# EAGLE design Exp_Board_Melzi (EAGLE 6.4)
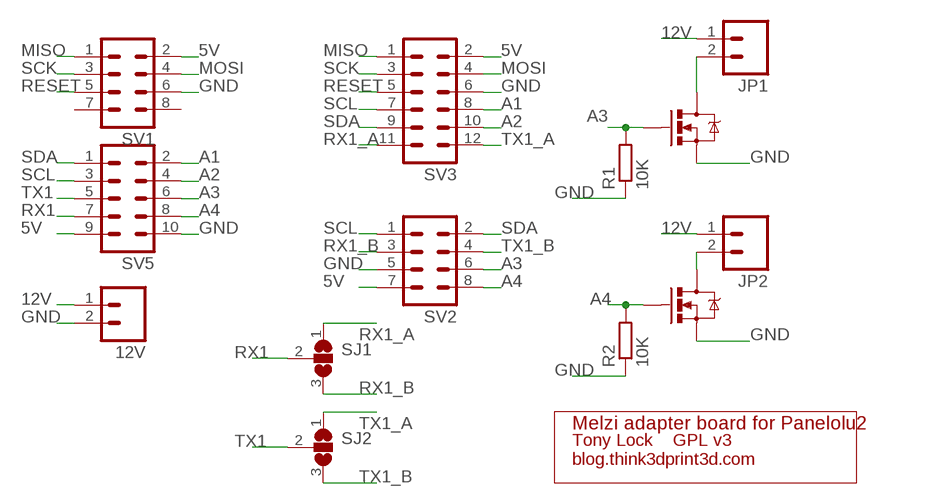
[diagram p0: schematic, sheet 1]

## Parts
12V  M02PTH  [1X02]
JP1  M02PTH  [1X02]
JP2  M02PTH  [1X02]
Q1  Transistor1  MOSFET-NCHANNELPTH2  [TO220V]
Q2  Transistor2  MOSFET-NCHANNELPTH2  [TO220V]
R1  10K  R-EU_0204/7  [0204/7]
R2  10K  R-EU_0204/7  [0204/7]
SJ1  SJ2W  [SJ_2]
SJ2  SJ2W  [SJ_2]
SV1  MA04-2  [MA04-2]
SV2  MA04-2  [MA04-2]
SV3  MA06-2  [MA06-2]
SV5  MA05-2  [MA05-2]

## Nets
5V: SV1.2 SV2.7 SV3.2 SV5.9
12V: JP1.1 JP2.1
A1: SV3.8 SV5.2
A2: SV3.10 SV5.4
A3: Q1.1(G) R1.2 SV2.6 SV5.6
A4: Q2.1(G) R2.2 SV2.8 SV5.8
GND: Q1.3(S) Q2.3(S) R1.1 R2.1 SV1.6 SV2.5 SV3.6 SV5.10
MISO: SV1.1 SV3.1
MOSI: SV1.4 SV3.4
N$1: JP1.2 Q1.2(D)
N$2: JP2.2 Q2.2(D)
RESET: SV1.5 SV3.5
RX1: SJ1.2 SV5.7
RX1_A: SJ1.1 SV3.11
RX1_B: SJ1.3 SV2.3
SCK: SV1.3 SV3.3
SCL: SV2.1 SV3.7 SV5.3
SDA: SV2.2 SV3.9 SV5.1
TX1: SJ2.2 SV5.5
TX1_A: SJ2.1 SV3.12
TX1_B: SJ2.3 SV2.4
Unconnected: 12V.1 12V.2 SV1.7 SV1.8

## Notes on the sheet
- Melzi adapter board for Panelolu2
- Tony Lock    GPL v3
  blog.think3dprint3d.com

## Library data of the parts
12V JP1 JP2 = SparkFun-Connectors:M02: Header 2 Standard 2-pin 0.1" header. Use with straight break away headers (SKU : PRT-00116), right angle break away headers (PRT-00553), swiss pins (PRT-00743), machine pins (PRT-00117), and female headers (PRT-00115). Molex polarized connector foot print use with SKU : PRT-08233 with associated crimp pins and housings.
Q1 Q2 = SparkFun-DiscreteSemi:MOSFET-NCHANNEL: Generic NMOS footprint
R1 R2 = resistor:R-EU_: RESISTOR, European symbol
SJ1 SJ2 = jumper:SJ2W: SMD solder JUMPER
SV1 SV2 = con-lstb_2:MA04-2: PIN HEADER; OC_FARNELL: unknown; OC_NEWARK: unknown
SV3 = con-lstb_2:MA06-2: PIN HEADER; OC_FARNELL: unknown; OC_NEWARK: unknown
SV5 = con-lstb_2:MA05-2: PIN HEADER; OC_FARNELL: unknown; OC_NEWARK: unknown

## Board
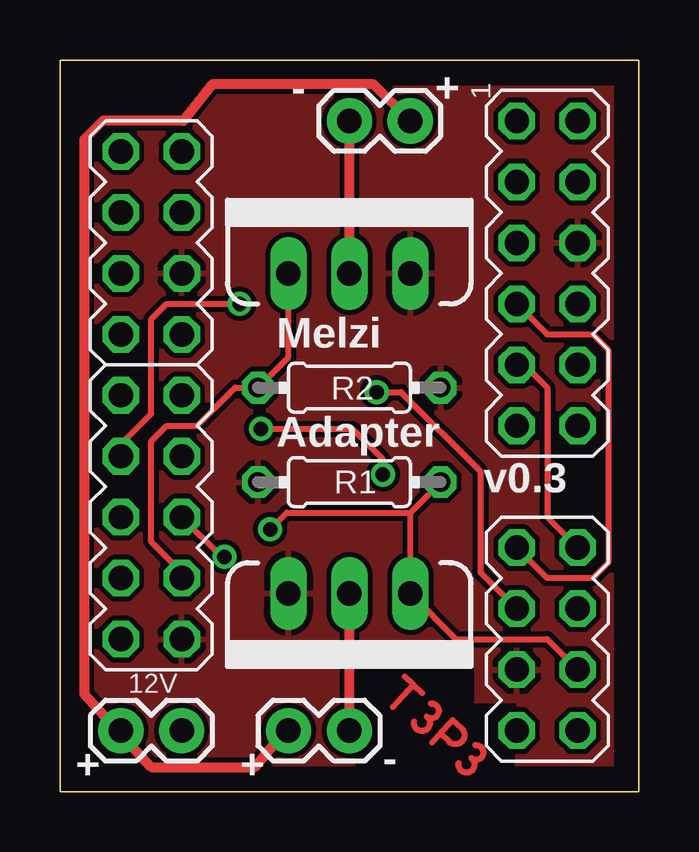
[diagram p1: board, top side]
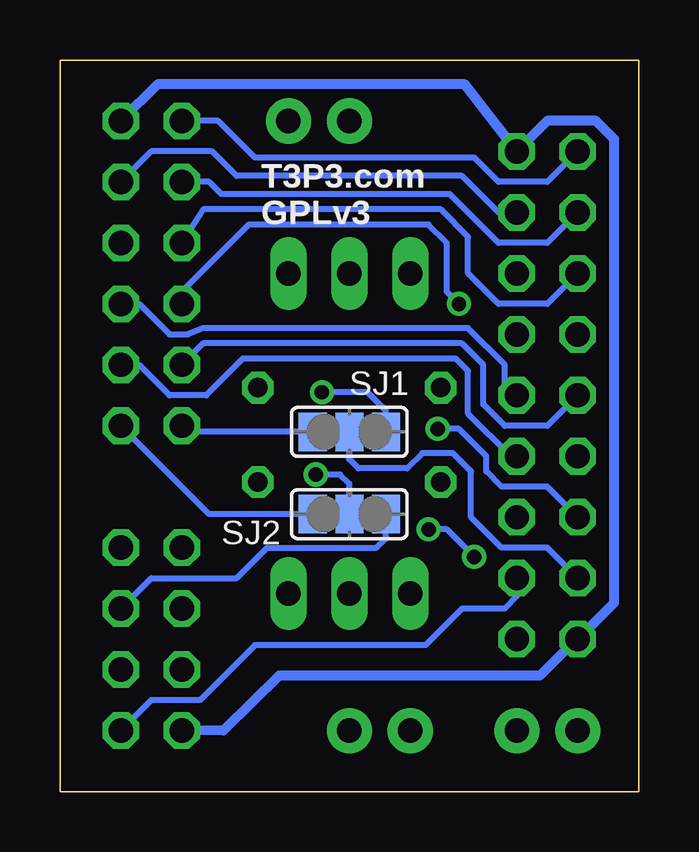
[diagram p2: board, bottom side, seen from below]

Size 24.13 x 30.48 mm. Coordinates in mm from the lower left corner, seen from the top.
Outline: 0,0 0,30.48 24.13,30.48 24.13,0 0,0
Copper layers (1*16): Top 0.035mm / dielectric 1.5mm / Bottom 0.035mm
Design rules: minimum track width 10mil, minimum drill 24mil, track to track 8mil, track to pad 8mil, pad to pad 8mil, via to via 8mil, smd to smd 8mil, copper to edge 40mil, drill to drill 8mil, minimum pad ring 10mil, minimum via ring 8mil, stop-mask expansion 4mil, vias tented up to drill 0mil, thermal gap 10mil

### Footprints (pad centres in the part's own frame; a part is rotated, then mirrored left to right if it is on the bottom)
1X02 = drill 1.016 pad 1.88: 1 0,0; 2 2.54,0
TO220V = drill 1.016 long: 1 -2.54,0; 2 0,0; 3 2.54,0
0204/7 = drill 0.813 octagon: 1 -3.81,0; 2 3.81,0
SJ_2 = smd 1.168 x 1.6: 1 -1.524,0; 2 0,0; 3 1.524,0
MA04-2 = drill 1.016 octagon: 1 -3.81,-1.27; 2 -3.81,1.27; 3 -1.27,-1.27; 4 -1.27,1.27; 5 1.27,-1.27; 6 1.27,1.27; 7 3.81,-1.27; 8 3.81,1.27
MA06-2 = drill 1.016 octagon: 1 -6.35,-1.27; 2 -6.35,1.27; 3 -3.81,-1.27; 4 -3.81,1.27; 5 -1.27,-1.27; 6 -1.27,1.27; 7 1.27,-1.27; 8 1.27,1.27; 9 3.81,-1.27; 10 3.81,1.27; 11 6.35,-1.27; 12 6.35,1.27
MA05-2 = drill 1.016 octagon: 1 -5.08,-1.27; 2 -5.08,1.27; 3 -2.54,-1.27; 4 -2.54,1.27; 5 0,-1.27; 6 0,1.27; 7 2.54,-1.27; 8 2.54,1.27; 9 5.08,-1.27; 10 5.08,1.27

### Placement (x,y rotation side)
12V  2.54,2.54 0 top
JP1  9.53,2.54 0 top
JP2  14.61,27.94 180 top
Q1  12.06,8.26 180 top
Q2  12.06,21.59 0 top
R1  12.06,12.89 0 top
R2  12.06,16.83 180 top
SJ1  12.06,14.99 0 bottom
SJ2  12.06,11.56 0 bottom
SV1  3.81,22.86 270 top
SV2  20.32,6.35 270 top
SV3  20.32,21.59 270 top
SV5  3.81,11.43 270 top

### Tracks (layer width: path | path; a pad name or v marks a point on that pad's centre or on a via)
5V
  Bottom 0.406: SV3.2 20.07,29.46 7.24,29.46 SV1.2 3.81,27.94 1.78,27.94 1.02,27.18 1.02,7.87 SV5.9 2.86,6.1 4.13,4.83 14.99,4.83 17.31,2.55 SV2.7
12V
  Top 0.406: JP2.1 13.08,29.46 6.35,29.46 5.14,27.94 1.78,27.94 1.02,27.18 1.02,4.06 3.81,1.02 8.13,1.02 9.4,2.54 JP1.1
A1
  Bottom 0.254: SV3.8 20.83,20.32 19.56,19.05 18.8,19.05 18.16,19.3 7.11,19.3 5.59,17.78 5.59,17.02 SV5.2
A2
  Bottom 0.254: SV3.10 20.83,17.78 19.56,16.51 18.03,16.51 16.51,18.03 7.62,18.03 7.11,17.53 7.11,15.75 5.33,13.97 SV5.4
A3  (via drill 0.6)
  Top 0.254: SV2.6 20.32,6.35 16.51,6.35 Q1.1 14.61,11.62 | 14.61,11.62 R1.2 | v8.76,10.92 9.46,11.62 14.61,11.62 | SV5.6 6.73,9.78 v6.86,9.78
  Bottom 0.254: Q1.1 14.61,8.51 | v6.86,9.78 8,10.92 v8.76,10.92
A4
  Top 0.254: SV5.8 5.08,9.14 3.81,10.41 3.81,14.61 4.45,15.24 5.71,15.24 7.3,16.83 R2.2 9.53,18.1 Q2.1
  Bottom 0.254: SV5.8 5.08,8.13 5.59,7.62 7.37,7.62 8.89,6.1 16,6.1 18.29,3.81 20.32,3.81 SV2.8
GND
  pour Top: 0,0 24.13,0 24.13,30.48 0,30.48
MISO
  Bottom 0.254: SV1.1 3.81,25.4 5.84,25.4 6.86,26.42 16,26.42 17.53,27.94 SV3.1
MOSI
  Bottom 0.254: SV1.4 5.84,24.13 7.37,25.65 16.76,25.65 17.78,26.67 20.32,26.67 SV3.4
N$1
  Top 0.406: JP1.2 Q1.2
N$2
  Top 0.406: Q2.2 JP2.2
N$3
  cutout Top: 12.45,0.51 12.45,5.08 17.14,5.08 17.14,3.56 18.92,3.56 18.8,0.51
N$4
  Top 0.254: 14.37,4.79 14.74,4.45 | 15.11,4.1 14.74,4.45 | 14.74,4.45 13.88,3.52
N$5
  Top 0.254: 15.46,3.66 arc-225 15.3,3.12 arc-243 14.76,2.92
N$6
  Top 0.254: 15.51,2.05 15.86,2.42 | 15.86,2.42 16.38,2.98 16.75,2.63 arc-180 16.23,2.07 15.86,2.42
N$7
  Top 0.254: 17.32,1.93 arc-225 17.15,1.39 arc-243 16.62,1.19
RESET
  Bottom 0.254: SV1.5 3.81,20.32 5.84,20.32 7.11,21.59 7.11,23.11 8.26,24.26 18.16,24.26 SV3.5
RX1
  Bottom 0.254: SV5.7 3.81,10.16 5.71,10.16 6.99,11.43 6.99,13.34 7.75,14.1 9.02,14.1 9.65,13.46 11.68,13.46 12.06,13.84 SJ1.2
RX1_A
  Bottom 0.254: SJ1.1 18.8,14.99 SV3.11
RX1_B  (via drill 0.6)
  Top 0.254: v13.21,16.64 14.22,16.64 17.53,13.34 17.53,9.14 SV2.3
  Bottom 0.254: SJ1.3 10.54,15.88 11.3,16.64 v13.21,16.64
SCK
  Bottom 0.254: SV1.3 3.81,22.86 5.84,22.86 7.87,24.89 17.4,24.89 17.91,25.4 SV3.3
SCL  (via drill 0.6)
  Top 0.254: SV2.1 20.32,8.89 22.23,8.89 22.86,9.53 22.86,18.41 22.23,19.05 20.32,19.05 SV3.7 | SV5.3 2.54,14.48 3.81,15.75 3.81,19.68 4.45,20.32 v7.49,20.32
  Bottom 0.254: v7.49,20.32 8,20.83 8,22.86 8.76,23.62 16.26,23.62 19.05,20.83 SV3.7
SDA
  Top 0.254: SV3.9 19.37,17.78 20.32,16.83 20.32,11.43 SV2.2
  Bottom 0.254: SV3.9 18.16,18.67 7.37,18.67 6.48,17.78 6.48,16.13 5.59,15.24 3.81,15.24 SV5.1
TX1  (via drill 0.6)
  Top 0.254: v8.38,15.11 12.19,15.11 13.46,13.84 v13.46,13.21
  Bottom 0.254: SV5.5 3.81,12.7 5.71,12.7 6.35,13.34 6.35,13.97 7.49,15.11 v8.38,15.11 | SJ2.2 12.06,12.83 12.45,13.21 v13.46,13.21
TX1_A
  Bottom 0.254: SJ2.1 17.91,11.56 SV3.12
TX1_B
  Bottom 0.254: SV2.4 20.32,8.89 16.76,8.89 15.49,10.16 10.92,10.16 10.54,10.54 SJ2.3

### Text on the board
tPlace: - | + | Melzi | Adapter | v0.3 | + | + | -
bPlace: T3P3.com | GPLv3